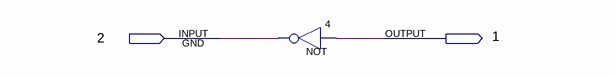
[diagram p0: schematic sheet]
// Quartus schematic 74LS04.bdf as structural Verilog: 1 symbols, 2 pins
module \74LS04  (
  input  \2 ,
  output \1 
);

  not u_4 (\2 , \1 );
endmodule
